# EAGLE design NexstarGPS (EAGLE 9.3.2)
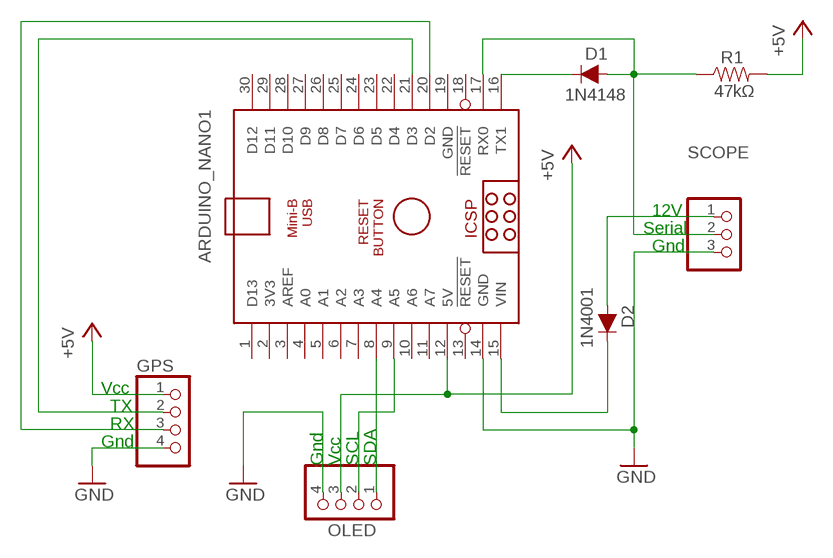
[diagram p0: schematic, sheet 1]

## Parts
ARDUINO_NANO1  ARDUINO_NANO  [ARDUINO_NANO]
D1  1N4148  DIODE-1N4148  [DIODE-1N4148]
D2  1N4001  DIODE-PTH  [DIODE-1N4001]
GPS  PINHD-1X4  [1X04]
OLED  PINHD-1X4  [1X04]
R1  47kΩ  RESISTORAXIAL-0.3  [AXIAL-0.3]
SCOPE  PINHD-1X3  [1X03]

## Nets
5V: ARDUINO_NANO1.12(5V) GPS.1 OLED.3 R1.P$2 ; supply symbol labelled +5V
12V: ARDUINO_NANO1.15(VIN) D2.C
GND: ARDUINO_NANO1.14(GND) GPS.4 OLED.4 SCOPE.3
GPSRX: ARDUINO_NANO1.20(D2) GPS.3
GPSTX: ARDUINO_NANO1.21(D3) GPS.2
N$1: D2.A SCOPE.1
NANOTX1: ARDUINO_NANO1.16(TX1) D1.C
OLEDSCL: ARDUINO_NANO1.9(A5) OLED.2
OLEDSDA: ARDUINO_NANO1.8(A4) OLED.1
SCOPESERIAL: ARDUINO_NANO1.17(RX0) D1.A R1.P$1 SCOPE.2
Unconnected: ARDUINO_NANO1.1(D13) ARDUINO_NANO1.2(3V3) ARDUINO_NANO1.3(AREF) ARDUINO_NANO1.4(A0) ARDUINO_NANO1.5(A1) ARDUINO_NANO1.6(A2) ARDUINO_NANO1.7(A3) ARDUINO_NANO1.10(A6) ARDUINO_NANO1.11(A7) ARDUINO_NANO1.13(!RESET) ARDUINO_NANO1.18(!RESET) ARDUINO_NANO1.22(D4) ARDUINO_NANO1.23(D5) ARDUINO_NANO1.24(D6) ARDUINO_NANO1.25(D7) ARDUINO_NANO1.26(D8) ARDUINO_NANO1.27(D9) ARDUINO_NANO1.28(D10) ARDUINO_NANO1.29(D11) ARDUINO_NANO1.30(D12)

## Notes on the sheet
- 12V
- Serial
- Gnd
- Vcc
- TX
- RX
- Gnd
- Gnd | Vcc | SCL | SDA

## Power pins joined to a net without a drawn wire
GND: ARDUINO_NANO1.19(GND)

## Library data of the parts
ARDUINO_NANO1 = ArduinoNanoV30:ARDUINO_NANO: Arduino Nano V3.0 Overview: The Arduino Nano is a small, complete, and breadboard-friendly board based on the ATmega328 (Arduino Nano 3.x) or ATmega168 (Arduino Nano 2.x). It has more or less the same functionality of the Arduino Duemilanove, but in a different package. It lacks only a DC power jack, and works with a Mini-B USB cable instead of a standard one. The Nano was designed and is being produced by Gravitech. Specifications: Microcontroller Atmel ATmega168 or ATmega328 Operating Voltage (logic level) 5 V Input Voltage (recommended) 7-12 V Input Voltage (limits) 6-20 V Digital I/O Pins 14 (of which 6 provide PWM output) Analog Input Pins 8 DC Current per I/O Pin 40 mA Flash Memory 16 KB (ATmega168) or 32 KB (ATmega328) of which 2 KB used by bootloader SRAM 1 KB (ATmega168) or 2 KB (ATmega328) EEPROM 512 bytes (ATmega168) or 1 KB (ATmega328) Clock Speed 16 MHz Dimensions 0.73" x 1.70" Length 45 mm Width 18 mm Weigth 5 g Power: The Arduino Nano can be powered via the Mini-B USB connection, 6-20V unregulated external power supply (pin 30), or 5V regulated external power supply (pin 27). The power source is automatically selected to the highest voltage source. Memory: The ATmega168 has 16 KB of flash memory for storing code (of which 2 KB is used for the bootloader); the ATmega328 has 32 KB, (also with 2 KB used for the bootloader). The ATmega168 has 1 KB of SRAM and 512 bytes of EEPROM (which can be read and written with the EEPROM library); the ATmega328 has 2 KB of SRAM and 1 KB of EEPROM. Input and Output: Each of the 14 digital pins on the Nano can be used as an input or output, using pinMode(), digitalWrite(), and digitalRead() functions. They operate at 5 volts. Each pin can provide or receive a maximum of 40 mA and has an internal pull-up resistor (disconnected by default) of 20-50 kOhms. In addition, some pins have specialized functions. Visit Arduino - ArduinoBoardNano <https://www.arduino.cc/en/Main/ArduinoBoardNano>
D1 = SparkFun-DiscreteSemi:DIODE: Diode These are standard reverse protection diodes and small signal diodes. SparkFun Products: SparkFun SparkPunk Sound Kit <https://www.sparkfun.com/products/11177> SparkFun ESP8266 Thing <https://www.sparkfun.com/products/13231>; PROD_ID: DIO-08378; VALUE: 200mA/100V/1V
D2 = SparkFun-DiscreteSemi:DIODE: Diode These are standard reverse protection diodes and small signal diodes. SparkFun Products: SparkFun SparkPunk Sound Kit <https://www.sparkfun.com/products/11177> SparkFun ESP8266 Thing <https://www.sparkfun.com/products/13231>; PROD_ID: DIO-09176; VALUE: 1A/50V/1.1V
GPS OLED = pinhead:PINHD-1X4: PIN HEADER
R1 = SparkFun-Resistors:RESISTOR: Generic Resistor Package
SCOPE = pinhead:PINHD-1X3: PIN HEADER

## Board
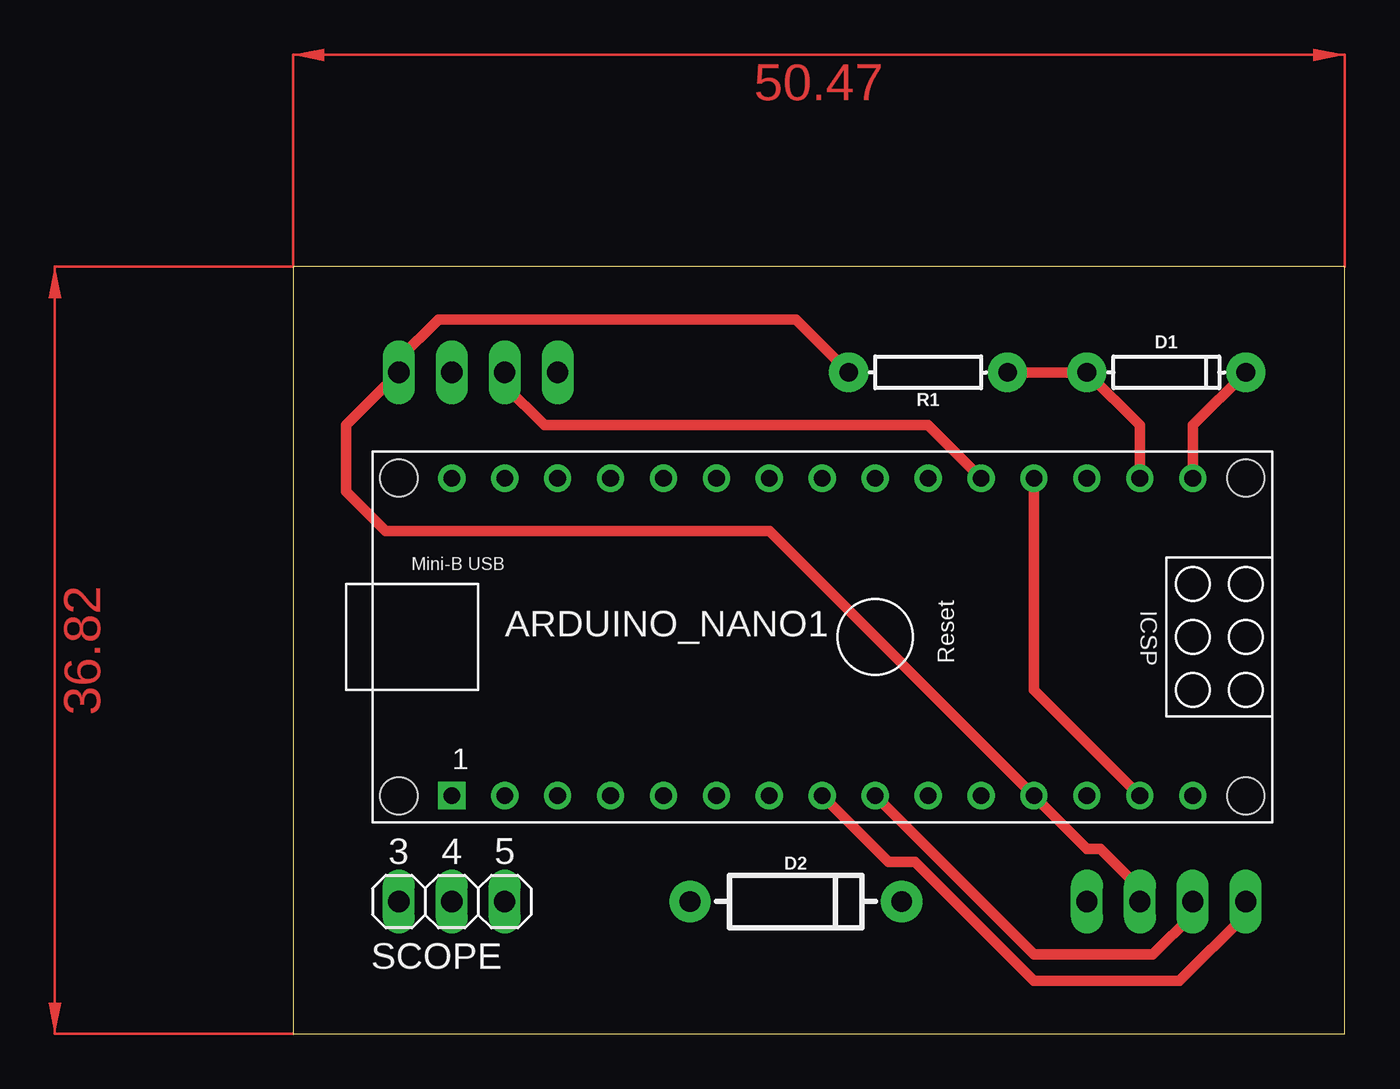
[diagram p1: board, top side]
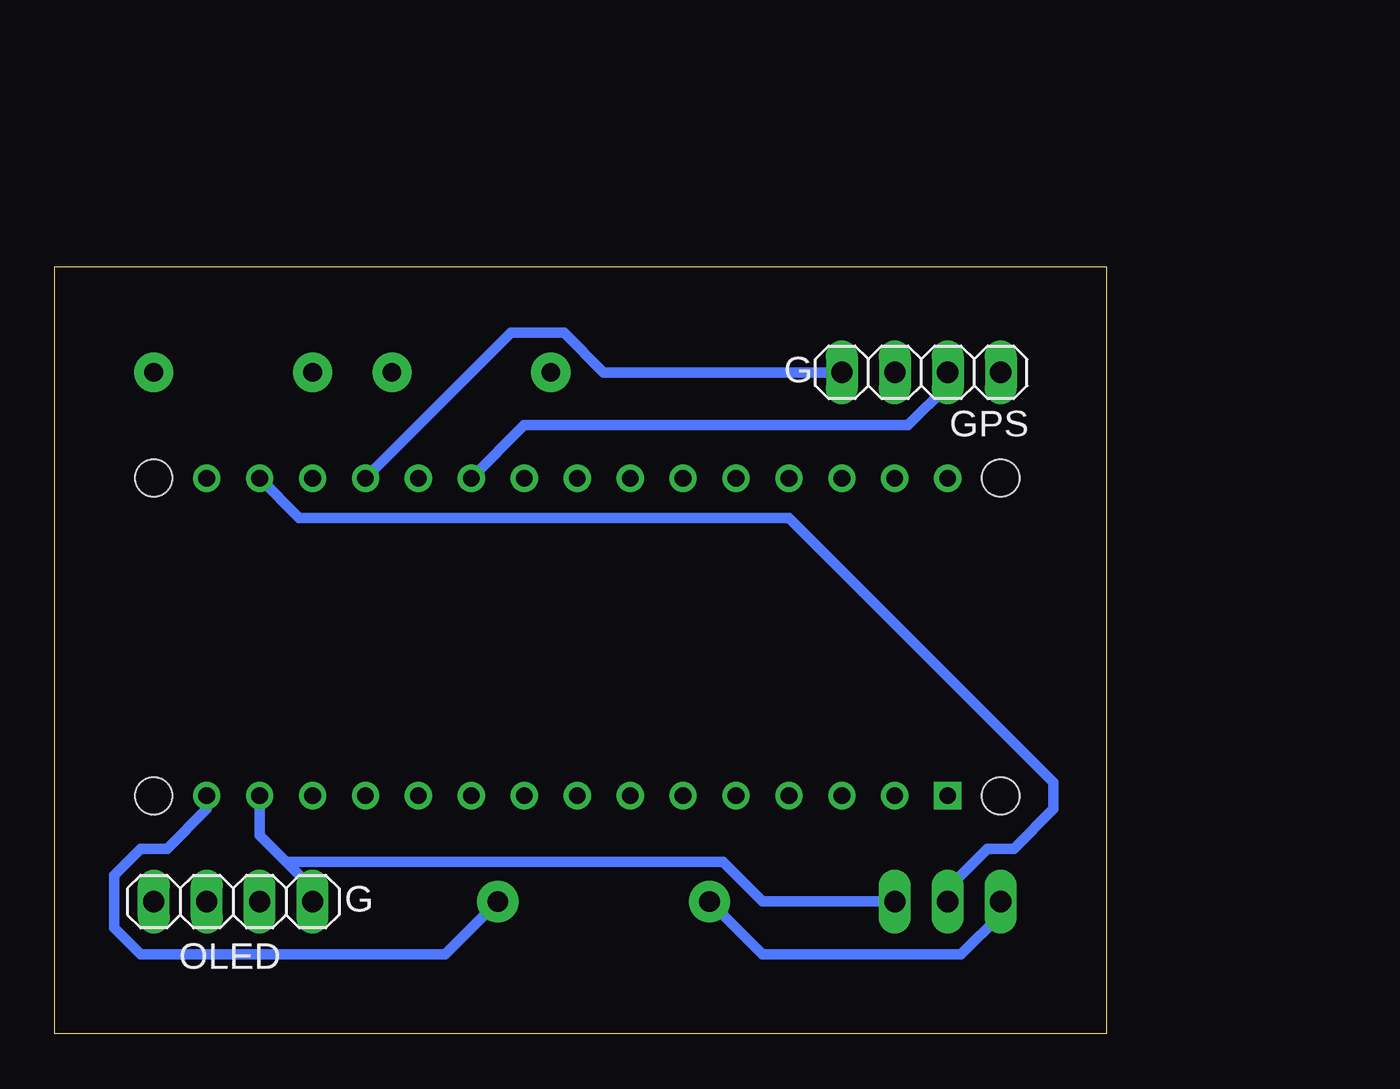
[diagram p2: board, bottom side, seen from below]

Size 50.47 x 36.82 mm. Coordinates in mm from the lower left corner, seen from the top.
Outline: 0,0 50.47,0 50.47,36.82 0,36.82 0,0
Copper layers (1*16): Top 0.035mm / dielectric 1.5mm / Bottom 0.035mm
Design rules "default *": minimum track width 20mil, minimum drill 0.35mm, track to track 15mil, track to pad 15mil, pad to pad 15mil, via to via 6mil, smd to smd 6mil, copper to edge 40mil, drill to drill 6mil, minimum pad ring 10mil, minimum via ring 8mil, stop-mask expansion 4mil, vias tented up to drill 0mil, thermal gap 10mil

### Footprints (pad centres in the part's own frame; a part is rotated, then mirrored left to right if it is on the bottom)
ARDUINO_NANO = drill 0.8 square: 1 -20.32,-7.62 | drill 0.8: 2 -17.78,-7.62; 3 -15.24,-7.62; 4 -12.7,-7.62; 5 -10.16,-7.62; 6 -7.62,-7.62; 7 -5.08,-7.62; 8 -2.54,-7.62; 9 0,-7.62; 10 2.54,-7.62; 11 5.08,-7.62; 12 7.62,-7.62; 13 10.16,-7.62; 14 12.7,-7.62; 15 15.24,-7.62; 16 15.24,7.62; 17 12.7,7.62; 18 10.16,7.62; 19 7.62,7.62; 20 5.08,7.62; 21 2.54,7.62; 22 0,7.62; 23 -2.54,7.62; 24 -5.08,7.62; 25 -7.62,7.62; 26 -10.16,7.62; 27 -12.7,7.62; 28 -15.24,7.62; 29 -17.78,7.62; 30 -20.32,7.62 | hole 1.778: -22.86,-7.62; -22.86,7.62; 17.78,7.62; 17.78,-7.62
DIODE-1N4148 = drill 0.9 pad 1.88: A -3.81,0; C 3.81,0
DIODE-1N4001 = drill 1 pad 1.981: A -5.08,0; C 5.08,0
1X04 = drill 1.016 long: 1 -3.81,0; 2 -1.27,0; 3 1.27,0; 4 3.81,0
AXIAL-0.3 = drill 0.9 pad 1.88: P$1 -3.81,0; P$2 3.81,0
1X03 = drill 1.016 long: 1 -2.54,0; 2 0,0; 3 2.54,0

### Placement (x,y rotation side)
ARDUINO_NANO1  27.94,19.05 0 top
D1  41.91,31.75 0 top
D2  24.13,6.35 0 top
GPS  8.89,31.75 180 bottom
OLED  41.91,6.35 0 bottom
R1  30.48,31.75 180 top
SCOPE  7.62,6.35 0 top

### Tracks (layer width: path | path; a pad name or v marks a point on that pad's centre or on a via)
5V
  Top 0.508: OLED.3 40.64,6.98 38.73,8.89 38.1,8.89 ARDUINO_NANO1.12 22.86,24.13 4.45,24.13 2.54,26.03 2.54,29.21 GPS.1 5.08,32.38 6.98,34.29 24.13,34.29 R1.P$2
12V
  Bottom 0.508: ARDUINO_NANO1.15 43.18,10.79 45.09,8.89 46.36,8.89 47.62,7.62 47.62,5.08 46.36,3.81 31.75,3.81 D2.C
GND
  Top 0.508: ARDUINO_NANO1.19 35.56,16.51 ARDUINO_NANO1.14
  Bottom 0.508: ARDUINO_NANO1.14 40.64,9.52 39.37,8.25 | 39.37,8.25 38.1,6.98 OLED.4 | SCOPE.3 16.51,6.35 18.42,8.25 39.37,8.25 | GPS.4 24.13,31.75 26.04,33.66 28.57,33.66 ARDUINO_NANO1.19
GPSRX
  Top 0.508: ARDUINO_NANO1.20 30.48,29.21 12.07,29.21 10.16,31.12 GPS.3
GPSTX
  Bottom 0.508: ARDUINO_NANO1.21 27.94,29.21 9.53,29.21 7.62,31.12 GPS.2
N$1
  Bottom 0.508: SCOPE.1 5.08,5.71 6.98,3.81 16.51,3.81 D2.A
NANOTX1
  Top 0.508: ARDUINO_NANO1.16 43.18,29.21 D1.C
OLEDSCL
  Top 0.508: ARDUINO_NANO1.9 35.56,3.81 41.28,3.81 43.18,5.71 OLED.2
OLEDSDA
  Top 0.508: ARDUINO_NANO1.8 28.57,8.25 29.85,8.25 35.56,2.54 42.55,2.54 45.72,5.71 OLED.1
SCOPESERIAL
  Top 0.508: ARDUINO_NANO1.17 40.64,29.21 D1.A R1.P$1
  Bottom 0.508: SCOPE.2 7.62,6.98 5.71,8.89 4.45,8.89 2.54,10.79 2.54,12.06 15.24,24.77 38.73,24.77 ARDUINO_NANO1.17
(copper drawn outside any net)
  shapes: Top area x2

### Text on the board
tPlace: 3 | 4 | 5
bPlace: G | G